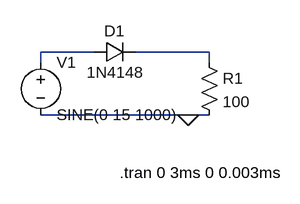
[diagram p0: schematic Clipper-1.asc]
Clipper-1.asc, the LTspice schematic file:
Version 4
SHEET 1 880 680
WIRE 160 128 80 128
WIRE 336 128 224 128
WIRE 80 144 80 128
WIRE 336 144 336 128
WIRE 304 224 80 224
WIRE 336 224 304 224
FLAG 304 224 0
SYMBOL diode 160 144 R270
WINDOW 0 32 32 VTop 2
WINDOW 3 0 32 VBottom 2
SYMATTR InstName D1
SYMATTR Value 1N4148
SYMBOL res 320 128 R0
SYMATTR InstName R1
SYMATTR Value 100
SYMBOL voltage 80 128 R0
WINDOW 123 0 0 Left 0
WINDOW 39 0 0 Left 0
SYMATTR InstName V1
SYMATTR Value SINE(0 15 1000)
TEXT 200 312 Left 2 !.tran 0 3ms 0 0.003ms

The netlist it stands for:
* Clipper-1.asc
D1 N001 N002 1N4148
R1 N002 0 100
V1 N001 0 SINE(0 15 1000)
.model D D
.lib standard.dio
.tran 0 3ms 0 0.003ms
.backanno
.end